# EAGLE design Ivy Sensor Shield (EAGLE 7.6.0)
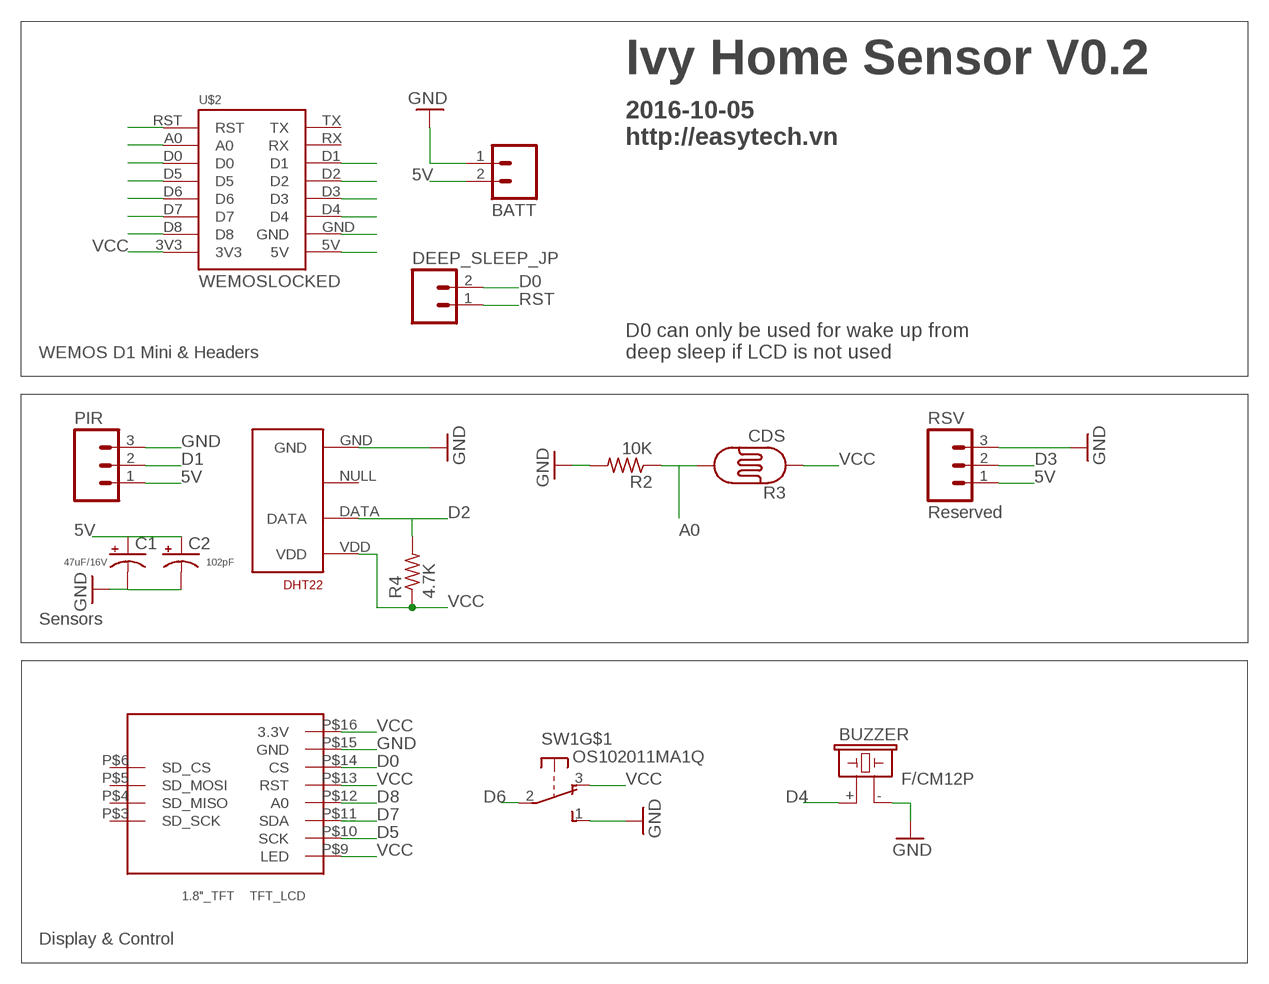
[diagram p0: schematic, sheet 1]

## Parts
BATT  M02PTH  [1X02]
BUZZER  F/CM12P  [F/CM12P]
C1  47uF/16V  CAP_POLPTH2  [CPOL-RADIAL-10UF-25V]
C2  102pF  CAP_POLPTH2  [CPOL-RADIAL-10UF-25V]
DEEP_SLEEP_JP  M02PTH  [1X02]
DHT22  RHT03_DHT-22_AM2302RA  [RHT03_DHT-22/RA]
PIR  M03PTH  [1X03]
R2  10K  R-US_R0805  [R0805]
R3  CDS  PHOTOCELL  [PHOTOCELL_THIN]
R4  4.7K  R-US_R0805  [R0805]
RSV  Reserved  M03PTH  [1X03]
SW1  OS102011MA1Q  [OS102011MA1Q]
TFT_LCD  1.8"_TFT  [1.8"_TFT]
U$2  WEMOSLOCKED  [WEMOS_LOCKED]

## Nets
5V: BATT.2 C1.1(+) C2.1(+) PIR.1 RSV.1 U$2.5V
A0: R2.1 R3.2 U$2.A0
D0: DEEP_SLEEP_JP.2 TFT_LCD.P$14(CS) U$2.D0
D1: PIR.2 U$2.D1
D2: DHT22.DATA R4.2 U$2.D2
D3: RSV.2 U$2.D3
D4: BUZZER.+ U$2.D4
D5: TFT_LCD.P$10(SCK) U$2.D5
D6: SW1.2(P) U$2.D6
D7: TFT_LCD.P$11(SDA) U$2.D7
D8: TFT_LCD.P$12(A0) U$2.D8
GND: BATT.1 BUZZER.- C1.2(-) C2.2(-) DHT22.GND PIR.3 R2.2 RSV.3 SW1.1(S) TFT_LCD.P$15(GND) U$2.GND
RST: DEEP_SLEEP_JP.1 U$2.RST
VCC: DHT22.VDD R3.1 R4.1 SW1.3(O) TFT_LCD.P$9(LED) TFT_LCD.P$13(RST) TFT_LCD.P$16(3.3V) U$2.3V3
Unconnected: DHT22.NULL SW1.MT1(MT) SW1.MT2(MT) TFT_LCD.P$3(SD_SCK) TFT_LCD.P$4(SD_MISO) TFT_LCD.P$5(SD_MOSI) TFT_LCD.P$6(SD_CS) U$2.RX U$2.TX

## Notes on the sheet
- Ivy Home Sensor V0.2
- 2016-10-05
  http://easytech.vn
- WEMOS D1 Mini & Headers
- D0 can only be used for wake up from 
  deep sleep if LCD is not used
- Sensors
- Display & Control

## Library data of the parts
BATT DEEP_SLEEP_JP = SparkFun-Connectors:M02: Standard 2-pin 0.1" header. Use with - straight break away headers ( PRT-00116) - right angle break away headers (PRT-00553) - swiss pins (PRT-00743) - machine pins (PRT-00117) - female headers (PRT-00115) Molex polarized connector foot print use with: PRT-08233 with associated crimp pins and housings. 2.54_SCREWTERM for use with PRT-10571. 3.5mm Screw Terminal footprints for PRT-08084 5mm Screw Terminal footprints for use with PRT-08432
BUZZER = buzzer:F/CM12P: BUZZER Source: Buerklin; OC_FARNELL: unknown; OC_NEWARK: unknown
C1 C2 = SparkFun-Capacitors:CAP_POL: Capacitor Polarized These are standard SMD and PTH capacitors. Normally 10uF, 47uF, and 100uF in electrolytic and tantalum varieties. Always verify the external diameter of the through hole cap, it varies with capacity, voltage, and manufacturer. The EIA devices should be standard.
DHT22 = RHT03_DHT-22_AM2302:RHT03_DHT-22_AM2302: RHT03 / DHT-22 / AM2302 Packages and symbol for the RHT03 / DHT-22 relative humidity and temperature sensor. Note: The AM2302 is a wired version of the DHT-22 which typically requires less clearance and is thus provided as a separate package.; PROD_ID: SEN-10167
PIR RSV = SparkFun-Connectors:M03: Header 3 Standard 3-pin 0.1" header. Use with straight break away headers (SKU : PRT-00116), right angle break away headers (PRT-00553), swiss pins (PRT-00743), machine pins (PRT-00117), and female headers (PRT-00115). Molex polarized connector foot print use with SKU : PRT-08232 with associated crimp pins and housings.
R2 R4 = resistor:R-US_: RESISTOR, American symbol
R3 = SparkFun-Sensors:PHOTOCELL: CdS photoresistor. This is a low cost way to detect light levels. Resistance decreases with more incoming light. SparkFun SKU: SEN-09088
SW1 = adafruit:OS102011MA1Q: OS10201MA1Q through-hole right angle switch http://www.ladyada.net/library/eagle
TFT_LCD = tft_1.8_1.44_oled_0.96:1.8"_TFT
U$2 = My Eagle Lib:WEMOS

## Board
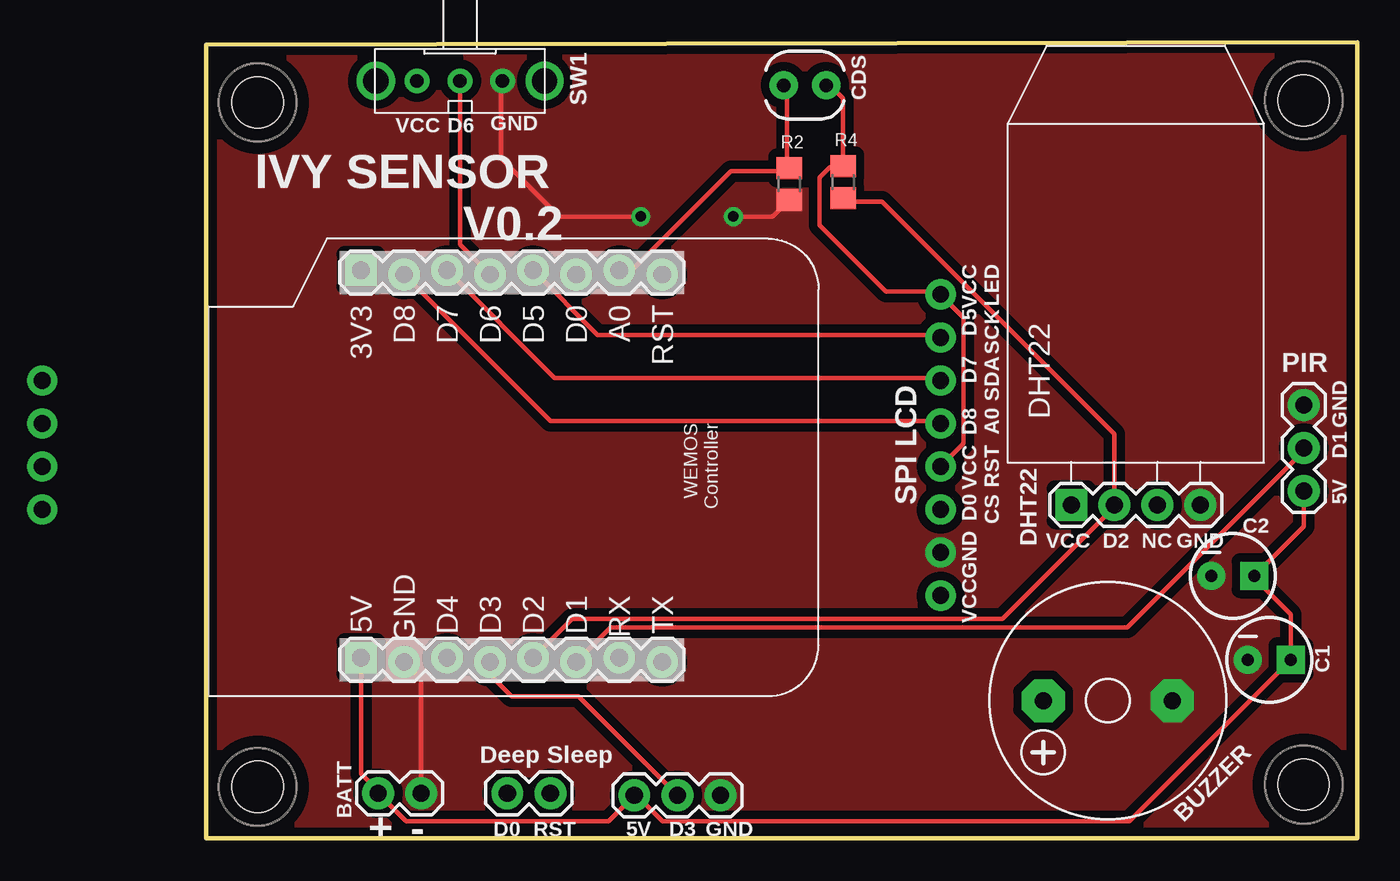
[diagram p1: board, top side]
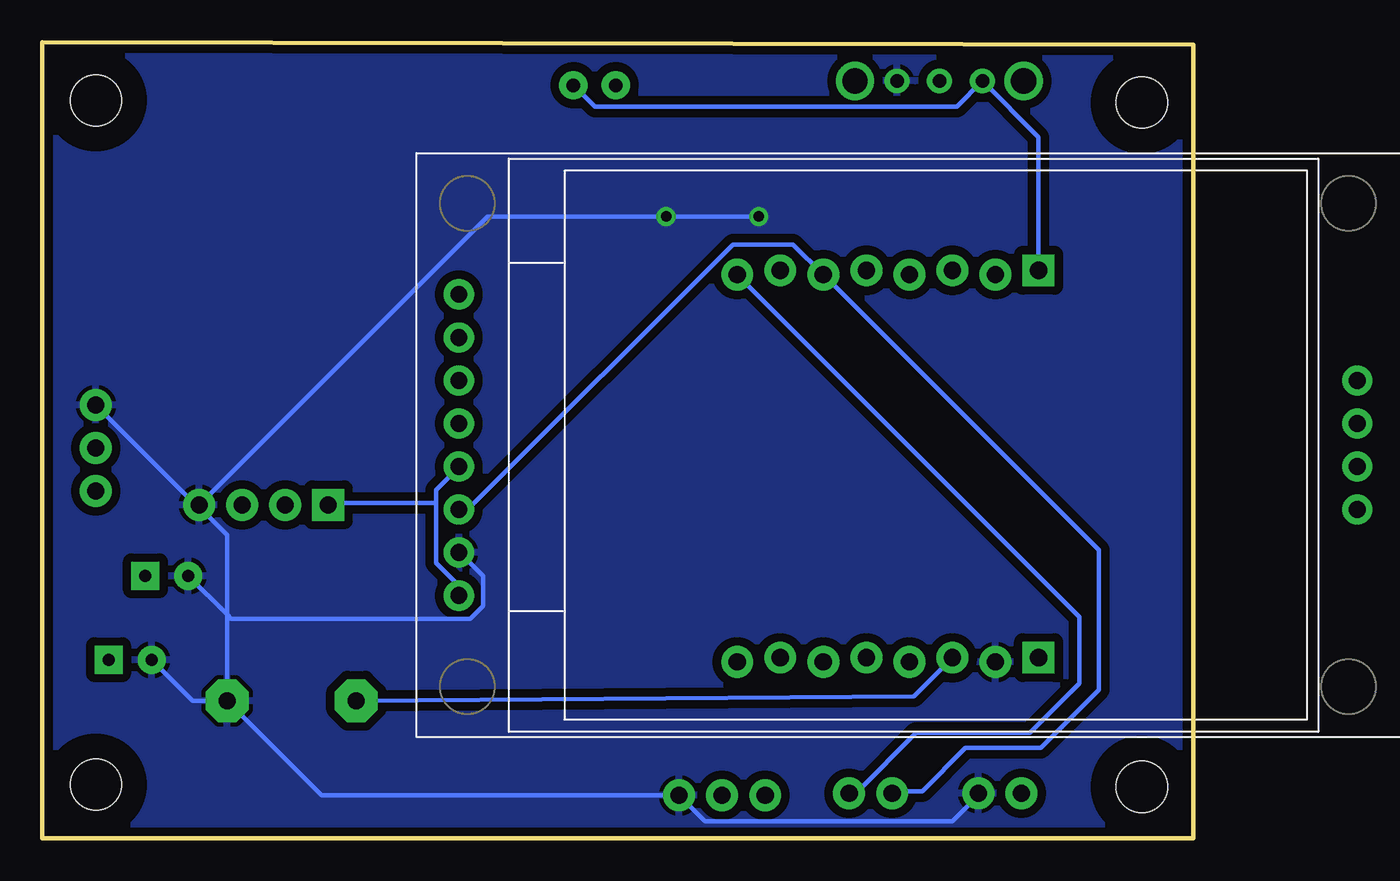
[diagram p2: board, bottom side, seen from below]

Size 67.92 x 46.98 mm. Coordinates in mm from the lower left corner, seen from the top.
Outline: 0,0 67.92,0 67.92,46.98 0,46.85 0,0
Copper layers (1*16): Top 0.035mm / dielectric 1.5mm / Bottom 0.035mm
Design rules "default *": minimum track width 10mil, minimum drill 24mil, track to track 10mil, track to pad 10mil, pad to pad 10mil, via to via 10mil, smd to smd 8mil, copper to edge 20mil, drill to drill 12mil, minimum pad ring 13mil, minimum via ring 10mil, stop-mask expansion 4mil, vias tented up to drill 0mil, thermal gap 10mil

### Footprints (pad centres in the part's own frame; a part is rotated, then mirrored left to right if it is on the bottom)
1X02 = drill 1.016 pad 1.88: 1 0,0; 2 2.54,0
F/CM12P = drill 1.016 pad 2.54 octagon: + 3.81,0; - -3.81,0
CPOL-RADIAL-10UF-25V = drill 0.7 pad 1.651 square: 1 1.27,0 | drill 0.7 pad 1.651: 2 -1.27,0
RHT03_DHT-22/RA = drill 1.016 pad 1.88: DATA -1.27,0; GND 3.81,0; NULL 1.27,0 | drill 1.016 pad 1.88 square: VDD -3.81,0
1X03 = drill 1.016 pad 1.88: 1 0,0; 2 2.54,0; 3 5.08,0
R0805 = smd 1.3 x 1.5: 1 -0.95,0; 2 0.95,0
PHOTOCELL_THIN = drill 0.8 pad 1.676: 1 -1.15,0; 2 1.35,0
OS102011MA1Q = drill 0.8 pad 1.422: 1 -2.508,0; 2 0,0; 3 2.535,0 | drill 1.5 pad 2.184: MT1 -4.989,0; MT2 4.962,0
1.8"_TFT = drill 1 pad 1.778: P$3 55.5,21.05; P$4 55.5,18.52; P$5 55.5,15.98; P$6 55.5,13.44; P$9 2.5,26.14; P$10 2.5,23.6; P$11 2.5,21.06; P$12 2.5,18.52; P$13 2.5,15.98; P$14 2.5,13.44; P$15 2.5,10.9; P$16 2.5,8.36
WEMOS_LOCKED = drill 1.016 pad 1.88 square: 3V3 -0.127,0; 5V 22.733,0 | drill 1.016 pad 1.88: A0 -0.127,15.24; D0 0.127,12.7; D1 22.987,12.7; D2 22.733,10.16; D3 22.987,7.62; D4 22.733,5.08; D5 -0.127,10.16; D6 0.127,7.62; D7 -0.127,5.08; D8 0.127,2.54; GND 22.987,2.54; RST 0.127,17.78; RX 22.733,15.24; TX 22.987,17.78
KFH-M3 = hole 3: 0,0

### Placement (x,y rotation side)
BATT  12.7,2.67 180 top
BUZZER  53.21,8.13 180 top
C1  62.74,10.54 0 top
C2  60.58,15.49 0 top
DEEP_SLEEP_JP  20.32,2.67 180 top
DHT22  54.86,19.69 0 top
PIR  64.77,20.5 90 top
R2  34.42,38.61 270 top
R3  35.43,44.45 180 top
R4  37.59,38.73 270 top
RSV  25.27,2.54 0 top
SW1  14.99,44.7 180 top
TFT_LCD  45.85,5.97 0 bottom
U$2  9.14,33.4 270 top
U$6  [KFH-M3]  3.05,3.05 0 top
U$7  [KFH-M3]  64.77,3.18 0 top
U$8  [KFH-M3]  64.77,43.56 0 top
U$9  [KFH-M3]  3.05,43.43 0 top

### Tracks (layer width: path | path; a pad name or v marks a point on that pad's centre or on a via)
5V
  Top 0.254: U$2.5V 9.14,3.81 10.16,2.79 BATT.2 11.81,1.02 23.75,1.02 RSV.1 25.4,2.54 26.92,1.02 54.48,1.02 C1.1 64.01,13.21 61.85,15.37 C2.1 64.77,18.41 PIR.1
A0
  Top 0.254: R3.2 34.29,44.45 34.29,39.62 R2.1 34.29,39.37 30.99,39.37 25.15,33.53 U$2.A0
D0
  Bottom 0.254: TFT_LCD.P$14 43.18,19.56 42.67,19.56 27.18,35.05 23.62,35.05 U$2.D0 5.59,17.02 5.59,8.76 9.02,5.33 13.46,5.33 16,2.79 17.78,2.79 DEEP_SLEEP_JP.2
D1
  Top 0.254: U$2.D1 23.88,12.45 54.36,12.45 64.77,22.86 PIR.2
D2
  Top 0.254: R4.2 37.59,37.59 39.88,37.59 53.59,23.88 DHT22.DATA 53.59,19.56 46.99,12.95 21.59,12.95 U$2.D2
D3
  Top 0.254: U$2.D3 16.76,9.65 18.03,8.38 21.97,8.38 RSV.2
D4
  Bottom 0.254: U$2.D4 16.51,8.38 BUZZER.+
D5
  Top 0.254: U$2.D5 23.11,29.72 43.18,29.72 TFT_LCD.P$10
D6
  Top 0.254: SW1.2 14.99,35.05 U$2.D6
D7
  Top 0.254: U$2.D7 20.57,27.18 43.18,27.18 TFT_LCD.P$11
D8
  Top 0.254: U$2.D8 20.32,24.64 43.18,24.64 TFT_LCD.P$12
GND  (via drill 0.61)
  Top 0.254: BATT.1 12.7,9.4 U$2.GND | v25.65,36.7 20.83,36.7 17.4,40.13 17.4,44.61 SW1.1 | v31.12,36.7 33.41,36.7 R2.2
  Bottom 0.254: BATT.1 12.7,2.54 14.22,1.02 28.83,1.02 RSV.3 51.43,2.54 BUZZER.- | DHT22.GND 58.67,19.56 57.02,17.91 57.02,13.21 | TFT_LCD.P$15 43.18,16.76 41.91,15.49 41.91,13.72 42.67,12.95 56.77,12.95 57.02,13.21 | v25.65,36.7 v31.12,36.7 41.66,36.7 DHT22.GND | DHT22.GND 58.42,19.94 59.13,19.94 PIR.3 | BUZZER.- 57.02,13.21 | 57.02,13.21 C2.2 | BUZZER.- 59.05,8.13 C1.2
  pour Bottom (isolate 0.508): -16.51,51.44 73.15,51.69 73.15,-3.56 -16.51,-3.81
  pour Top (isolate 0.508, no thermals): -16.51,51.44 73.15,51.69 73.15,-3.56 -16.51,-3.81
RST
  Bottom 0.254: U$2.RST 6.73,13.08 6.73,9.14 9.65,6.22 16.38,6.22 19.81,2.79 20.32,2.79 DEEP_SLEEP_JP.1
VCC
  Top 0.254: R4.1 37.59,43.69 36.83,44.45 R3.1 | 37.59,39.62 R4.1 | TFT_LCD.P$13 44.7,23.31 44.7,30.73 43.43,32 TFT_LCD.P$9 43.18,32.26 40.13,32.26 36.2,36.2 36.2,38.99 36.83,39.62 37.53,39.62 R4.1
  Bottom 0.254: 44.7,19.81 44.7,20.57 43.43,21.84 TFT_LCD.P$13 | 44.7,19.81 44.7,16.26 43.43,14.99 43.43,14.48 TFT_LCD.P$16 | 44.7,19.81 51.05,19.81 DHT22.VDD | R3.1 35.31,43.18 13.98,43.18 SW1.3 9.14,41.4 U$2.3V3

### Text on the board
tNames: VCC | D6 | GND | IVY SENSOR / V0.2 | VCC / LED | D5 / SCK | D7 / SDA | GND | D8 / A0 | VCC / RST | D1 | DHT22 | 5V | D0 / CS | SPI LCD | GND | VCC | D2 | NC | GND | VCC | Deep Sleep | D0 | RST | + | - | 5V | D3 | GND